# EAGLE design esp_all (EAGLE 7.7.0)
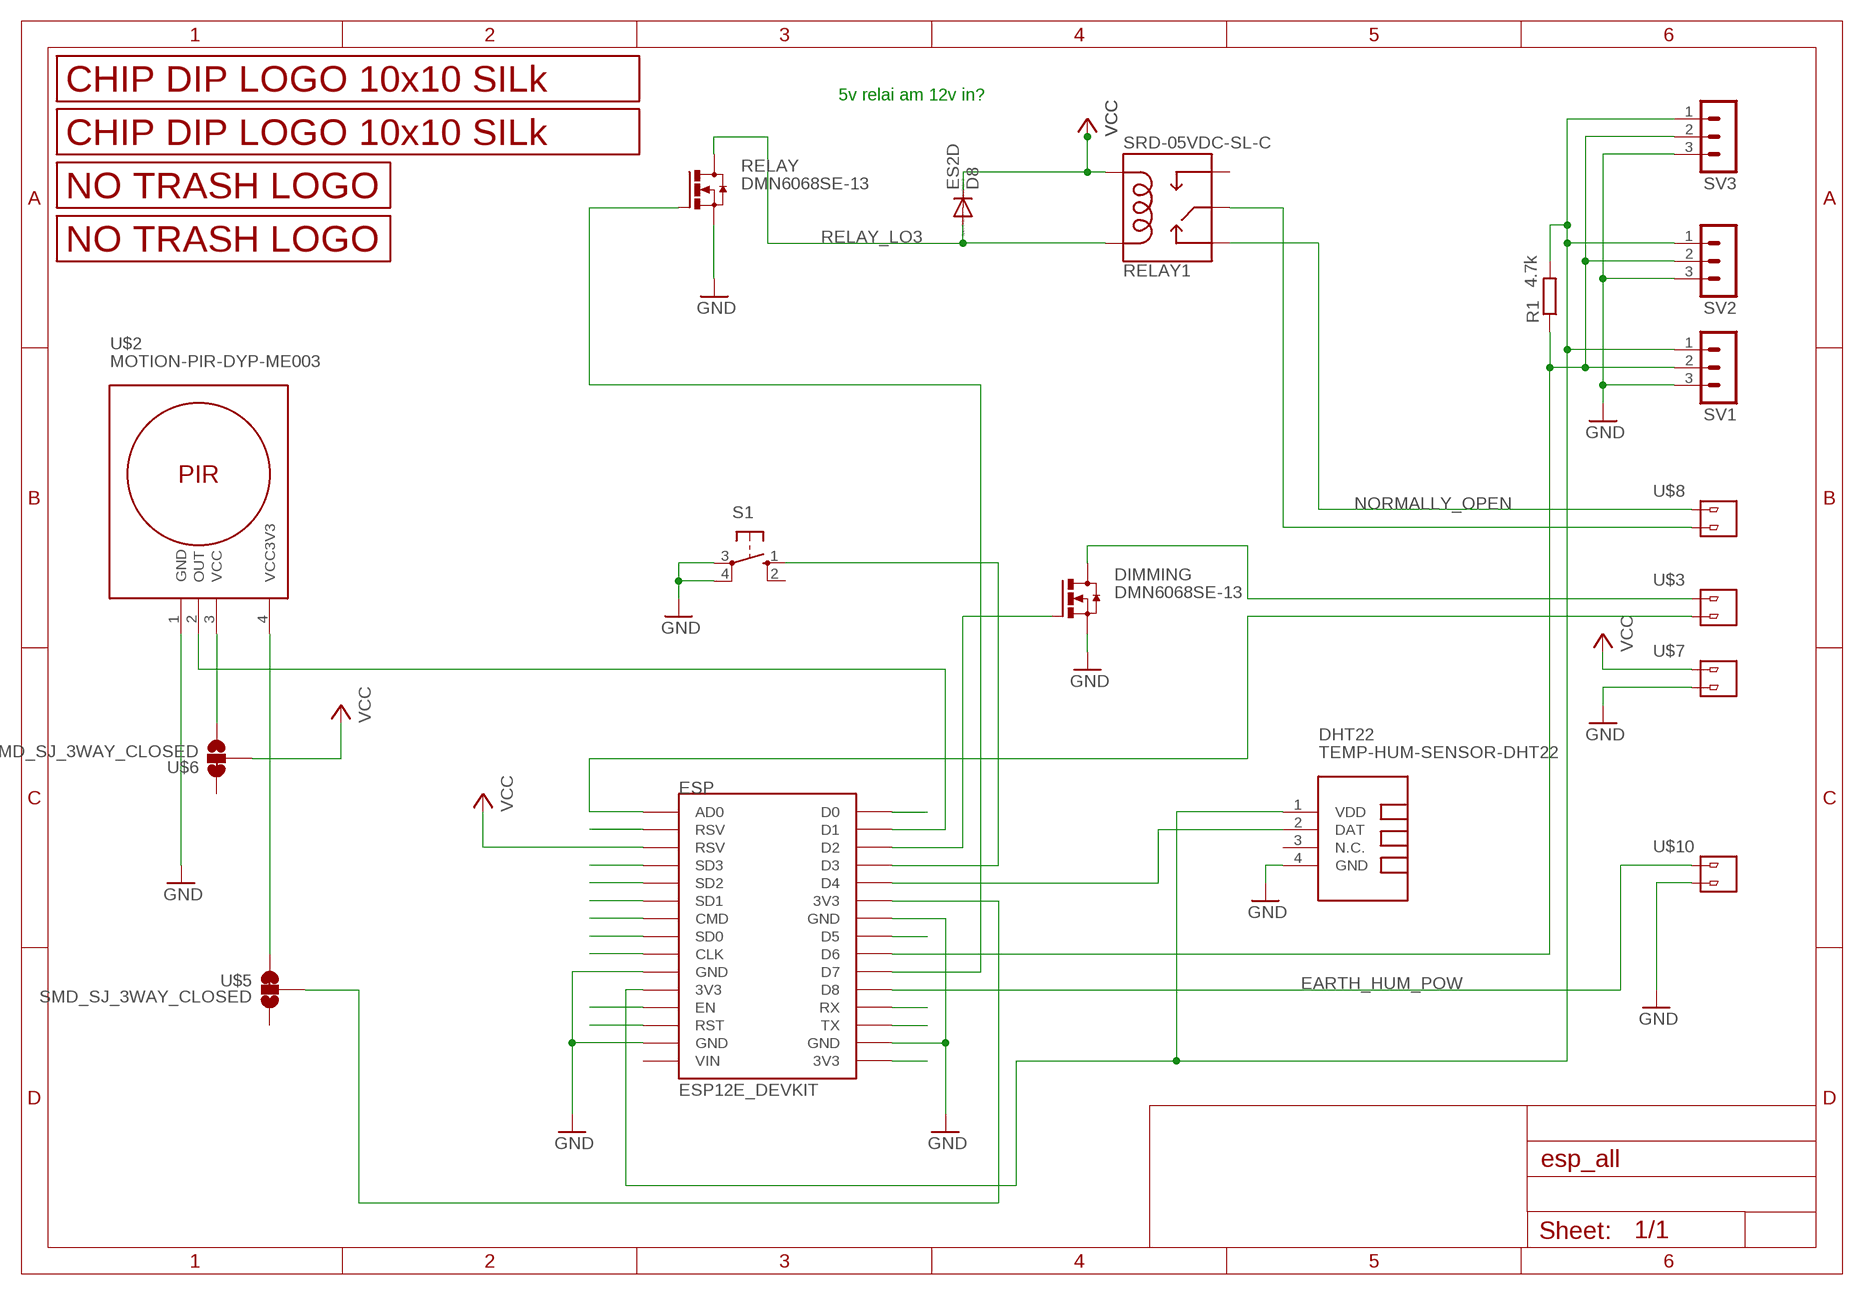
[diagram p0: schematic, sheet 1]

## Parts
D8  ES2D  DIODE-SMB  [SMB]
DHT22  TEMP-HUM-SENSOR-DHT22  [TEMP-HUM-SENSOR-DHT22]
DIMMING  DMN6068SE-13  NMOSFET_SMD_223  [SOT223]
ESP  ESP12E_DEVKIT  [ESP12E_DEVKIT]
R1  4.7k  R-EU_M0805  [M0805]
RELAY  DMN6068SE-13  NMOSFET_SMD_223  [SOT223]
RELAY1  SRD-05VDC-SL-C  RELAYPTH  [SRD-05VDC-SL-C]
S1  40/XX  [B3F/40XX]
SV1  MA03-1  [MA03-1]
SV2  MA03-1  [MA03-1]
SV3  MA03-1  [MA03-1]
U$1  LOGO_10X10_SILK  [LOGO2_10X10_SILK]
U$2  MOTION-PIR-DYP-ME003  [MOTION-PIR-DYP-ME003]
U$3  V1  2_PIN_CONNECTOR  [2_SCREW_PIN]
U$4  LOGO_NO_TRASHNO_TRASH  [LOGO_ROHS_NO_TRASH]
U$5  SMD_SJ_3WAY_CLOSED  [SMD_SJ_3WAY_CLOSED]
U$6  SMD_SJ_3WAY_CLOSED  [SMD_SJ_3WAY_CLOSED]
U$7  V1  2_PIN_CONNECTOR  [2_SCREW_PIN]
U$8  V1  2_PIN_CONNECTOR  [2_SCREW_PIN]
U$9  LOGO_NO_TRASHROHS  [LOGO_ROHS_SYM]
U$10  V1  2_PIN_CONNECTOR  [2_SCREW_PIN]
U$11  LOGO_10X10_SILK  [LOGO2_10X10_SILK]

## Nets
EARTH_HUM_POW: ESP.D8 U$10.P$1
GND: DHT22.4(GND) DIMMING.3(S) ESP.GND@0(GND) ESP.GND@1(GND) ESP.GND@2(GND) ESP.GND@3(GND) RELAY.3(S) S1.3(P) S1.4(P1) SV1.3 SV2.3 SV3.3 U$2.1(GND) U$7.P$2 U$10.P$2
IN1: RELAY1.SWCOMMON U$8.P$2
N$1: ESP.AD0 U$3.P$2
N$2: ESP.RSV@0(RSV)
N$4: ESP.SD3
N$5: ESP.SD2
N$6: ESP.SD1
N$7: ESP.CMD
N$8: ESP.SD0
N$9: ESP.CLK
N$10: ESP.D7 RELAY.1(G)
N$11: ESP.3V3@2(3V3)
N$12: ESP.EN
N$13: ESP.RST
N$15: ESP.D6 R1.1 SV1.2 SV2.2 SV3.2
N$16: DHT22.1(VDD) ESP.3V3@0(3V3) R1.2 SV1.1 SV2.1 SV3.1
N$17: DIMMING.2(D) DIMMING.4(D) U$3.P$1
N$18: ESP.TX
N$19: ESP.RX
N$23: ESP.D5
N$24: U$2.4(VCC3V3) U$5.1
N$25: ESP.3V3@1(3V3) U$5.2
N$26: DHT22.2(DAT) ESP.D4
N$27: ESP.D3 S1.1(S)
N$28: DIMMING.1(G) ESP.D2
N$29: ESP.D1 U$2.2(OUT)
N$30: ESP.D0
N$31: U$2.3(VCC) U$6.3
NORMALLY_OPEN: RELAY1.SWCLOSED(SWCLOSE) U$8.P$1
RELAY_LO3: D8.A RELAY1.COIL1 RELAY.2(D) RELAY.4(D)
VCC: D8.C ESP.RSV@1(RSV) RELAY1.COIL0 U$6.2 U$7.P$1
Unconnected: DHT22.3(N.C.) ESP.VIN RELAY1.SWOPEN S1.2(S1) U$5.3 U$6.1

## Notes on the sheet
- 5v relai am 12v in?

## Library data of the parts
D8 = diode:DIODE-: DIODE
DHT22 = diy-modules:TEMP-HUM-SENSOR-DHT22: DHT22 - digital humidity & temperature sensor Also known as: AM2302 AM2302 datasheet available here: http://akizukidenshi.com/download/ds/aosong/AM2302.pdf Click here to find device on ebay.com <http://www.ebay.com/sch/dht22+digital+sensor>
DIMMING RELAY = transistor-power:NMOSFET_SMD_223
ESP = ESP12E_DEVKIT:ESP12E_DEVKIT: ESP12E DEVKIT BOARD
R1 = rcl:R-EU_: RESISTOR, European symbol
RELAY1 = JKW_CHIP:RELAY: SPDT relay (COM-00101)
S1 = switch-omron:40/XX: OMRON SWITCH; OC_FARNELL: unknown; OC_NEWARK: unknown
SV1-SV3 = con-lstb:MA03-1: PIN HEADER; OC_FARNELL: unknown; OC_NEWARK: unknown
U$1 U$11 = JKW_CHIP:LOGO_10X10_SILK
U$2 = diy-modules:MOTION-PIR-DYP-ME003: PIR Motion Sensor Module DYP-ME003 based on BISS0001 pyroelectic detector Click here to find device on ebay.com <http://www.ebay.com/sch/dyp+me003>
U$3 U$7 U$8 U$10 = JKW_CHIP:2_PIN_CONNECTOR
U$4 U$9 = JKW_CHIP:LOGO_NO_TRASH
U$5 U$6 = JKW_CHIP:SMD_SJ_3WAY_CLOSED

## Board
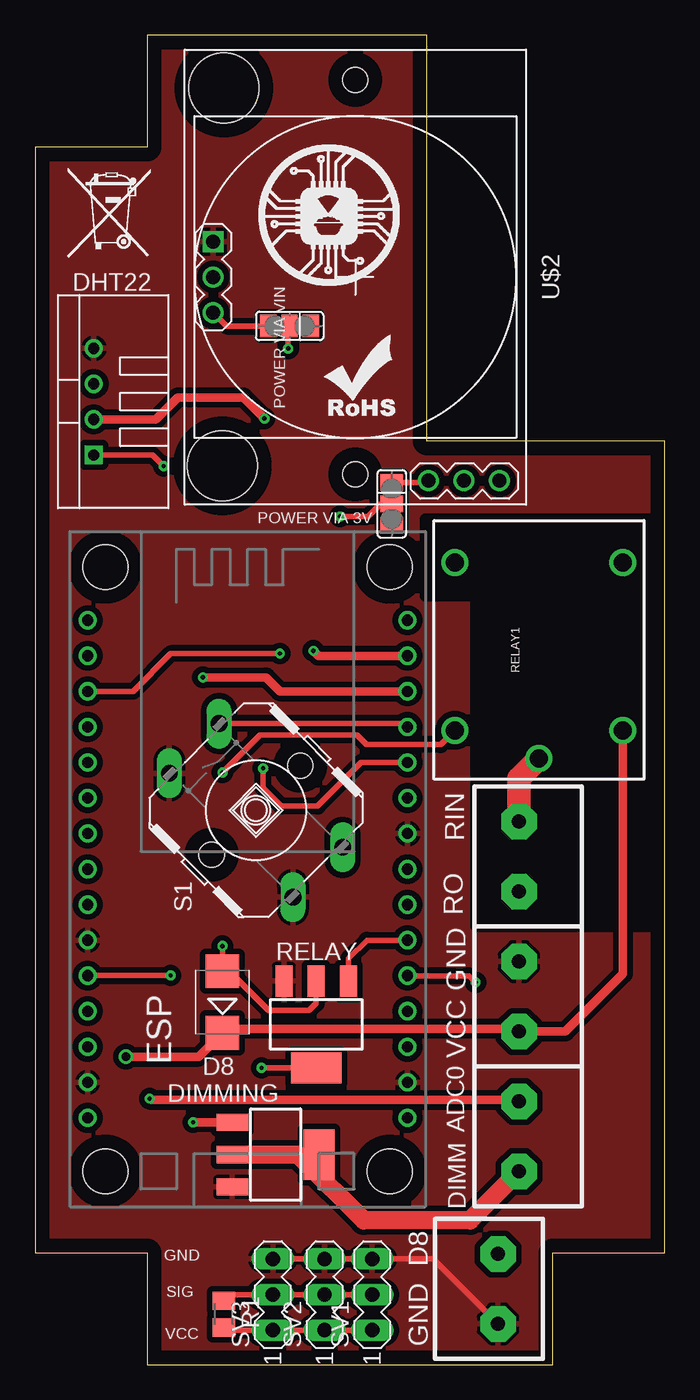
[diagram p1: board, top side]
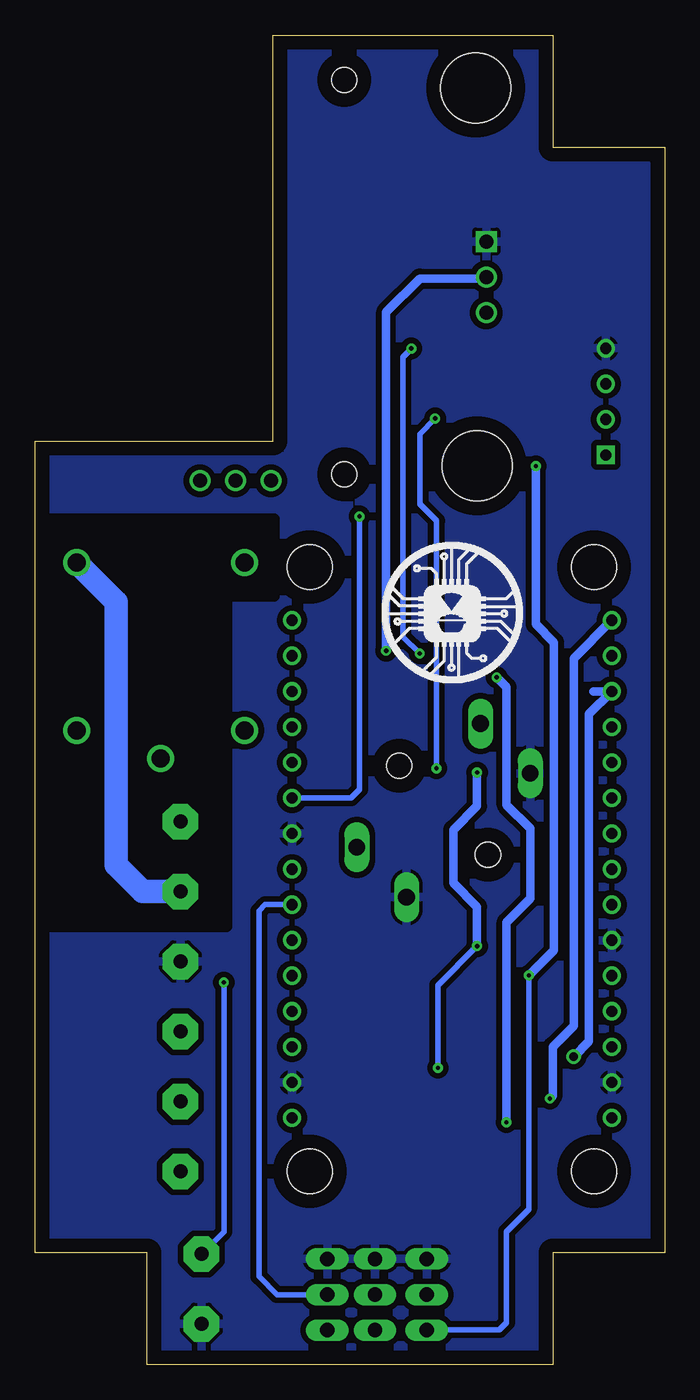
[diagram p2: board, bottom side, seen from below]

Size 45 x 95 mm. Coordinates in mm from the lower left corner, seen from the top.
Outline: 8,0 37,0 37,8 45,8 45,66 28,66 28,95 8,95 8,87 0,87 0,8 8,8 8,0
Copper layers (1*16): Top 0.035mm / dielectric 1.5mm / Bottom 0.035mm
Design rules "default": minimum track width 10mil, minimum drill 24mil, track to track 8mil, track to pad 8mil, pad to pad 8mil, via to via 8mil, smd to smd 8mil, copper to edge 40mil, drill to drill 8mil, minimum pad ring 10mil, minimum via ring 8mil, stop-mask expansion 4mil, vias tented up to drill 0mil, thermal gap 10mil
Holes 5 mm at 13.4,64.2 13.5,91.2
tRestrict: area 31.5,31.3 to 44,60.4; area 27.9,54.9 to 31.9,60.4
bRestrict: area 31.3,31.3 to 43.6,60.4; area 27.9,54.9 to 31.8,60.4

### Footprints (pad centres in the part's own frame; a part is rotated, then mirrored left to right if it is on the bottom)
SMB = smd 2.4 x 2.4: A 2.2,0; C -2.2,0
TEMP-HUM-SENSOR-DHT22 = drill 0.8 square: 1 -3.81,0 | drill 0.8: 2 -1.27,0; 3 1.27,0; 4 3.81,0
SOT223 = smd 1.219 x 2.235: 1 -2.311,-3.099; 2 0,-3.099; 3 2.311,-3.099 | smd 3.6 x 2.2: 4 0,3.099
ESP12E_DEVKIT = drill 0.8: 3V3@0 -11.43,-7.62; 3V3@1 11.43,5.08; 3V3@2 11.43,-17.78; AD0 -11.43,17.78; CLK -11.43,-2.54; CMD -11.43,2.54; D0 11.43,17.78; D1 11.43,15.24; D2 11.43,12.7; D3 11.43,10.16; D4 11.43,7.62; D5 11.43,0; D6 11.43,-2.54; D7 11.43,-5.08; D8 11.43,-7.62; EN -11.43,-10.16; GND@0 -11.43,-5.08; GND@1 -11.43,-15.24; GND@2 11.43,2.54; GND@3 11.43,-15.24; RST -11.43,-12.7; RSV@0 -11.43,15.24; RSV@1 -11.43,12.7; RX 11.43,-10.16; SD0 -11.43,0; SD1 -11.43,5.08; SD2 -11.43,7.62; SD3 -11.43,10.16; TX 11.43,-12.7; VIN -11.43,-17.78 | hole 3.2: -10.16,21.59; 10.16,21.59; 10.16,-21.59; -10.16,-21.59
M0805 = smd 1.3 x 1.6: 1 -0.95,0; 2 0.95,0
SRD-05VDC-SL-C = drill 1.3: COIL0 -5.39,-6.12; COIL1 -5.39,5.88; SWCLOSED 6.61,-6.12; SWCOMMON -7.39,-0.12; SWOPEN 6.61,5.88
B3F/40XX = drill 1.194 long: 1 -6.198,-2.642; 2 2.642,6.198; 3 -2.642,-6.198; 4 6.198,2.642 | hole 1.803: -3.175,3.175; 3.175,-3.175
MA03-1 = drill 1.016 long: 1 -2.54,0; 2 0,0; 3 2.54,0
MOTION-PIR-DYP-ME003 = drill 1 square: 1 -2.54,-10.16 | drill 1: 2 0,-10.16; 3 2.54,-10.16; 4 14.54,5.23; 5 14.54,7.77; 6 14.54,10.31 | hole 1.8: -14.1,0; 14.1,0
2_SCREW_PIN = drill 1 pad 2.54 octagon: P$1 -2.5,0.5; P$2 2.5,0.5
SMD_SJ_3WAY_CLOSED = smd 1.168 x 1.6: 1 -1.524,0; 2 0,0; 3 1.524,0

### Placement (x,y rotation side)
D8  13.4,25.9 90 top
DHT22  4.2,68.8 90 top
DIMMING  17.2,15 270 top
ESP  15.2,35.4 0 top
R1  13.5,3.6 270 top
RELAY  20.1,24.3 180 top
RELAY1  35.9,50.7 90 top
S1  15.8,39.6 270 top
SV1  24.1,5 90 top
SV2  20.7,5 90 top
SV3  17,5 90 top
U$1  20.2,48.7 0 bottom
U$2  22.9,77.7 270 top
U$3  35.1,16.3 90 top
U$4  2.3,79.1 0 top
U$5  25.5,61.5 270 top
U$6  18.2,74.2 180 top
U$7  35.1,26.3 90 top
U$8  35.1,36.3 90 top
U$9  20.2,67.7 0 top
U$10  32.6,5.4 270 top
U$11  16,77.1 0 top

### Tracks (layer width: path | path; a pad name or v marks a point on that pad's centre or on a via)
EARTH_HUM_POW  (via drill 0.3)
  Top 0.406: v31.5,27.3 31.02,27.78 ESP.D8
  Bottom 0.406: U$10.P$1 31.5,9.5 v31.5,27.3
GND
  Top 0.406: SV3.3 SV2.3 SV1.3 28.46,7.54 U$10.P$2
  pour Top (isolate 0.406, rank 6): 8.4,94.7 27.5,94.7 27.5,65.7 44.7,65.7 44.7,63 44.7,8.2 36.6,8.2 36.6,0.4 8.3,0.4 8.3,6.9 8.3,8.2 0.1,8.2 0.1,86.8 8.5,86.8 8.5,94.4
  pour Bottom (isolate 0.406): 9.1,94.2 26.9,94.2 26.9,64.9 43.7,64.9 43.7,9 36.5,9 36.5,0.5 9.1,0.5 9.1,8.7 1.3,8.7 1.3,85.8 8.7,85.8 8.7,93.9
IN1
  Top 1.676: U$8.P$2 34.6,41.89 RELAY1.SWCOMMON
N$1  (via drill 0.3)
  Top 0.61: v8.2,19 8.3,18.9 34.5,18.9 U$3.P$2
  Bottom 0.61: v8.2,19 8,19.2 8,22.7 6.5,24.2 6.5,50.45 ESP.AD0
N$10
  Top 0.406: RELAY.1 22.41,29.01 23.72,30.32 ESP.D7
N$15
  Top 0.406: SV1.2 SV2.2 SV3.2 13.95,5 R1.1
  Bottom 0.406: SV1.2 27.7,5 29,6.3 29,32.4 28.54,32.86 ESP.D6
N$16  (via drill 0.3)
  Top 0.406: ESP.3V3@0 3.79,27.8 v9.7,27.8 | R1.2 13.69,2.46 SV3.1 SV2.1 SV1.1 | DHT22.1 8.41,64.99 v9.2,64.2
  Bottom 0.406: v9.7,27.8 9.7,11.1 11.3,9.5 11.3,3 11.8,2.5 16.96,2.5 SV3.1
  Bottom 0.61: v9.7,27.8 7.9,29.6 7.9,51.6 9.2,52.9 v9.2,64.2
N$17
  Top 0.61: DIMMING.4 19.4,15 19.1,14.7
  Top 1.27: U$3.P$1 31.1,10.3 23.5,10.3 19.1,14.7 18.8,15 DIMMING.2
N$24
  Top 0.406: U$2.4 27.99,63.02 U$5.1
N$25  (via drill 0.3)
  Top 0.406: 25.4,61.6 U$5.2 24.7,61.5 23.8,60.6 v21.8,60.6
  Bottom 0.406: v21.8,60.6 21.8,41.1 22.4,40.5 26.61,40.5 ESP.3V3@1
N$26  (via drill 0.3)
  Top 0.406: ESP.D4 23.32,43.02 20.2,39.9 17.6,39.9 16.3,41.2 v16.3,42.6 | 4.27,67.6 DHT22.2
  Top 0.61: v16.4,67.6 14.9,69.1 10.2,69.1 8.63,67.53 DHT22.2
  Bottom 0.406: v16.3,42.6 16.3,60.3 17.5,61.5 17.5,66.5 v16.4,67.6
N$27
  Top 0.406: ESP.D3 26.39,45.8 S1.1
N$28  (via drill 0.3)
  Top 0.61: DIMMING.1 v11.31,17.31 v11.3,17.3 | v12,49.1 16.5,49.1 17.5,48.1 ESP.D2
  Bottom 0.61: v12,49.1 11.3,48.4 11.3,40 9.6,38.3 9.6,33.3 11.3,31.6 v11.3,17.3
N$29  (via drill 0.3)
  Top 0.61: ESP.D1 20.26,50.64 v19.9,51
  Bottom 0.61: v19.9,51 19.9,75.2 17.5,77.6 12.84,77.6 U$2.2
N$31
  Top 0.406: U$2.3 13.7,74.2 U$6.3
NORMALLY_OPEN
  Bottom 1.676: U$8.P$1 37.3,33.8 39.2,35.7 39.2,54.49 RELAY1.SWCLOSED
RELAY_LO3  (via drill 0.3)
  Top 0.406: RELAY1.COIL1 29.01,44.3 23.7,44.3 23,45 16.1,45 v13.4,42.3 | v13.4,29.9 D8.A | D8.A 13.4,27.5 | D8.A 13.9,28.1 16.7,25.3 19.6,25.3 20.1,25.8 RELAY.2 | RELAY.4 v16.2,21.2
  Bottom 0.406: v16.2,21.2 16.2,27.1 v13.4,29.9
  Bottom 0.61: v13.4,29.9 13.4,32.7 15.1,34.4 15.1,38.2 13.4,39.9 v13.4,42.3
VCC  (via drill 0.3, 0.6)
  Top 0.406: U$6.2 18.1,74.1 v18.1,72.6 | v17.5,50.8 9.7,50.8 7,48.1 ESP.RSV@1
  Top 0.61: RELAY1.COIL0 42.02,27.92 37.9,23.8 U$7.P$1 34.4,24 13.7,24 D8.C 11.7,22 v6.5,22
  Bottom 0.406: v17.5,50.8 18.7,52 18.7,72 v18.1,72.6
  Bottom 0.61: 5.1,48.1 ESP.RSV@1 5.4,46.47 5.4,23.1 v6.5,22

### Text on the board
tNames: POWER VIA VIN | POWER VIA 3V | RIN | RO | GND | VCC | ADC0 | DIMM | GND | D8 | SIG | VCC | GND